# EAGLE design xyz (EAGLE 9.6.2)
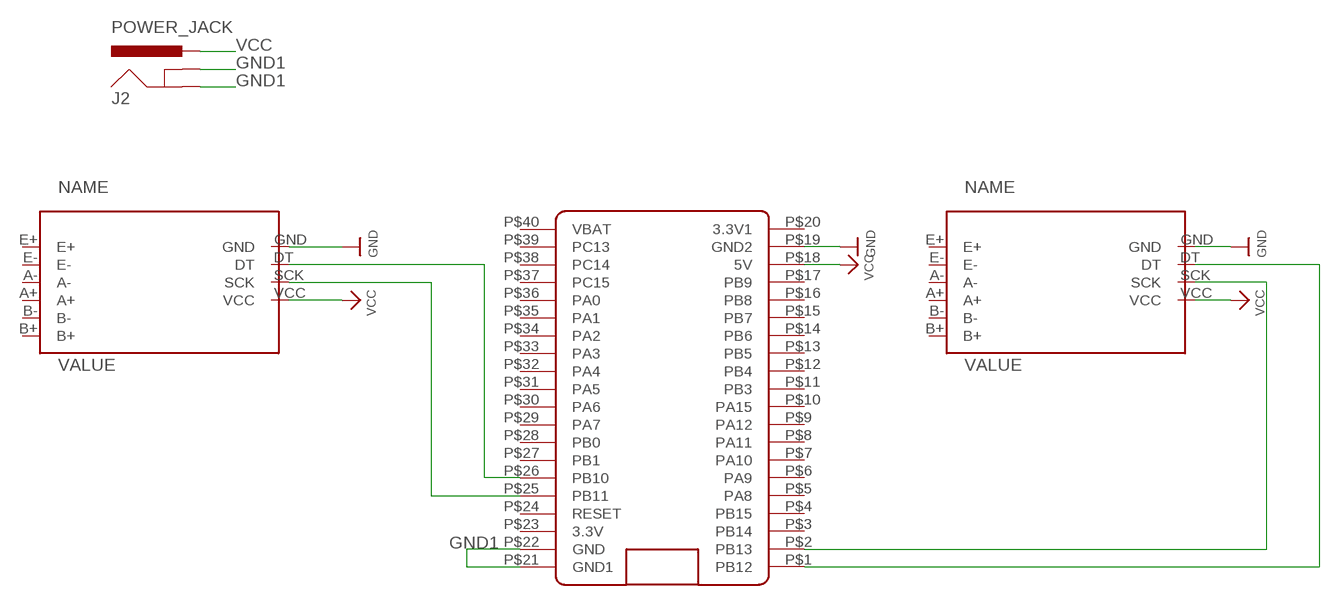
[diagram p0: schematic, sheet 1]

## Parts
J2  POWER_JACK  [POWER_JACK]
U$1  HX711A  [HX711]
U$2  HX711A  [HX711]
U$3  BLUE_PILL  [BLUE_PILL]

## Nets
GND: U$1.GND U$2.GND U$3.P$19(GND2)
GND1: J2.GNDBREAK U$3.P$21(GND1) U$3.P$22(GND)
N$1: J2.GND
N$3: U$1.DT U$3.P$26(PB10)
N$4: U$1.SCK U$3.P$25(PB11)
N$5: U$2.SCK U$3.P$2(PB13)
N$6: U$2.DT U$3.P$1(PB12)
VCC: J2.PWR U$1.VCC U$2.VCC U$3.P$18(5V)
Unconnected: U$1.A+ U$1.A- U$1.B+ U$1.B- U$1.E+ U$1.E- U$2.A+ U$2.A- U$2.B+ U$2.B- U$2.E+ U$2.E- U$3.P$3(PB14) U$3.P$4(PB15) U$3.P$5(PA8) U$3.P$6(PA9) U$3.P$7(PA10) U$3.P$8(PA11) U$3.P$9(PA12) U$3.P$10(PA15) U$3.P$11(PB3) U$3.P$12(PB4) U$3.P$13(PB5) U$3.P$14(PB6) U$3.P$15(PB7) U$3.P$16(PB8) U$3.P$17(PB9) U$3.P$20(3.3V1) U$3.P$23(3.3V) U$3.P$24(RESET) U$3.P$27(PB1) U$3.P$28(PB0) U$3.P$29(PA7) U$3.P$30(PA6) U$3.P$31(PA5) U$3.P$32(PA4) U$3.P$33(PA3) U$3.P$34(PA2) U$3.P$35(PA1) U$3.P$36(PA0) U$3.P$37(PC15) U$3.P$38(PC14) U$3.P$39(PC13) U$3.P$40(VBAT)

## Library data of the parts
J2 = J-Generic-5.5mm-Barrel-Jack:POWER_JACK: Power Jack Connector This is the standard 5.5mm barrel jack for power. The PTH is the most common, proven, reliable, footprint. The Slot footprint only works if the mill layer is transmitted to the PCB fab house so be warned. Here are the connectors we sell at SparkFun: DC Barrel Power Jack/Connector <https://www.sparkfun.com/products/119> (PRT-00119) DC Barrel Power Jack/Connector (SMD) <https://www.sparkfun.com/products/12748> (PRT-12748) DC Barrel Jack Adapter - Breadboard Compatible <https://www.sparkfun.com/products/10811> (PRT-10811) It is used on this SparkFun product (and many, many others): SparkFun RedBoard - Programmed with Arduino <https://www.sparkfun.com/products/12757> (DEV-12757) Also, if you need a mating power supply or connector, please check these out: Wall Adapter Power Supply - 9VDC 650mA <https://www.sparkfun.com/products/298> (TOL-00298) DC Barrel Jack Adapter - Male <https://www.sparkfun.com/products/10287> (PRT-10287); DPN: CP-202A-ND; MPN: PJ-202A
U$1 U$2 = HX711:HX711
U$3 = BluePill:BLUE_PILL

## Net classes
0 default: width 0.3 mm, drill 0.203 mm, clearance 0.3 mm

## Board
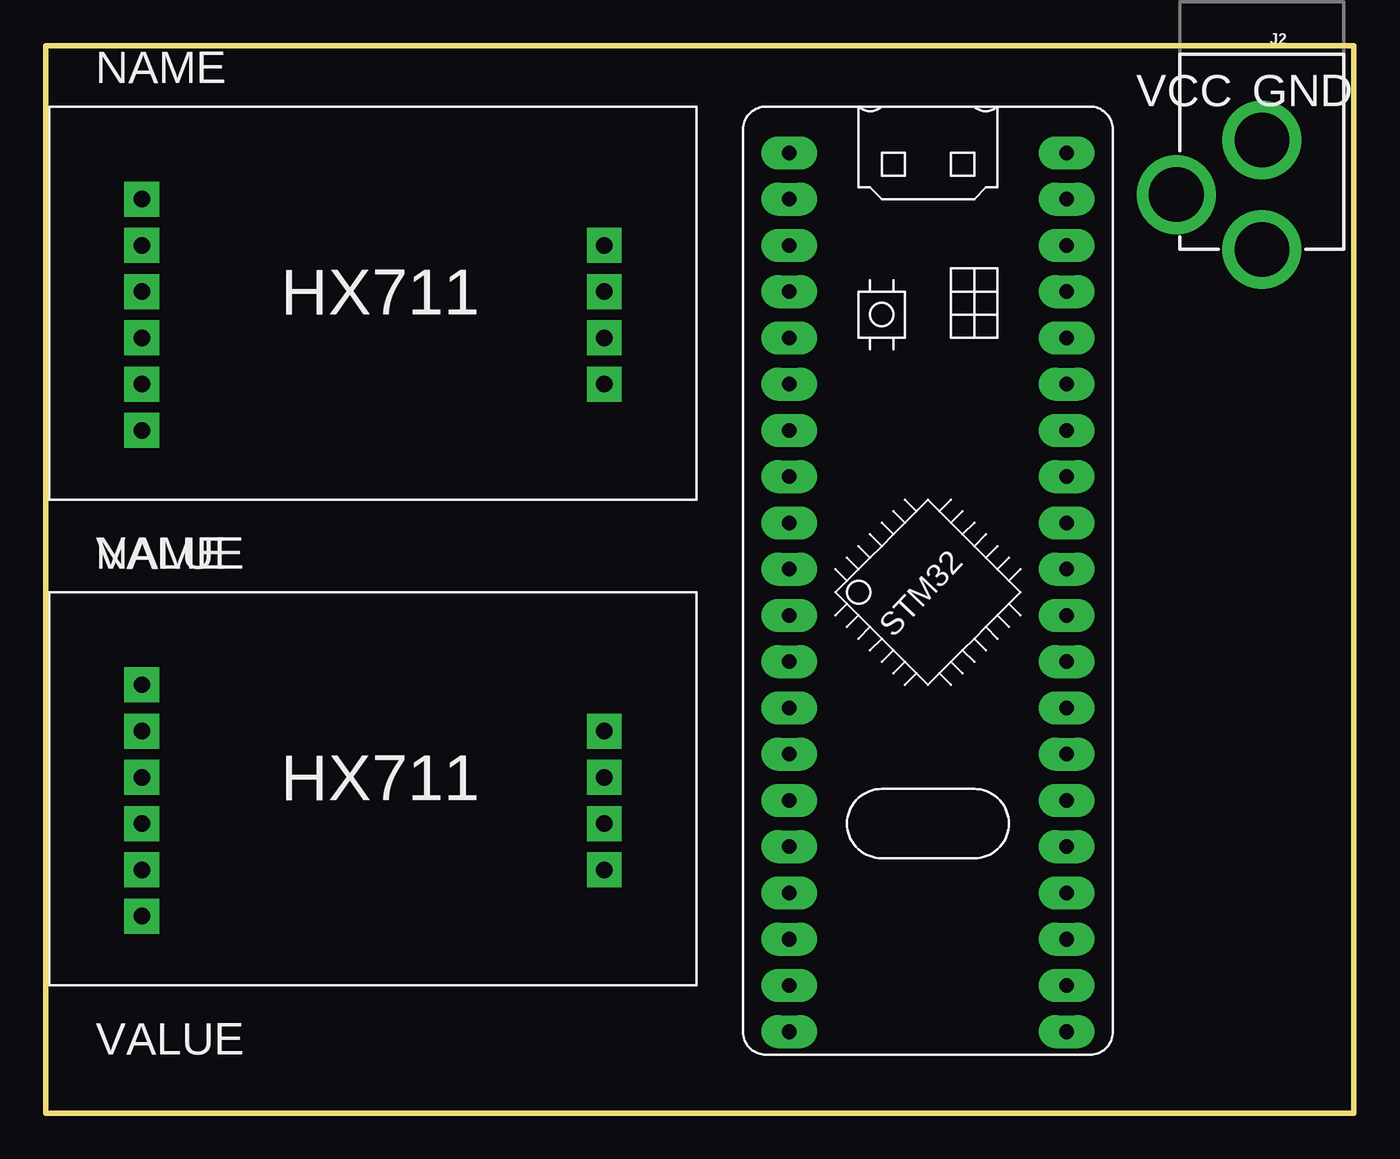
[diagram p1: board, top side]
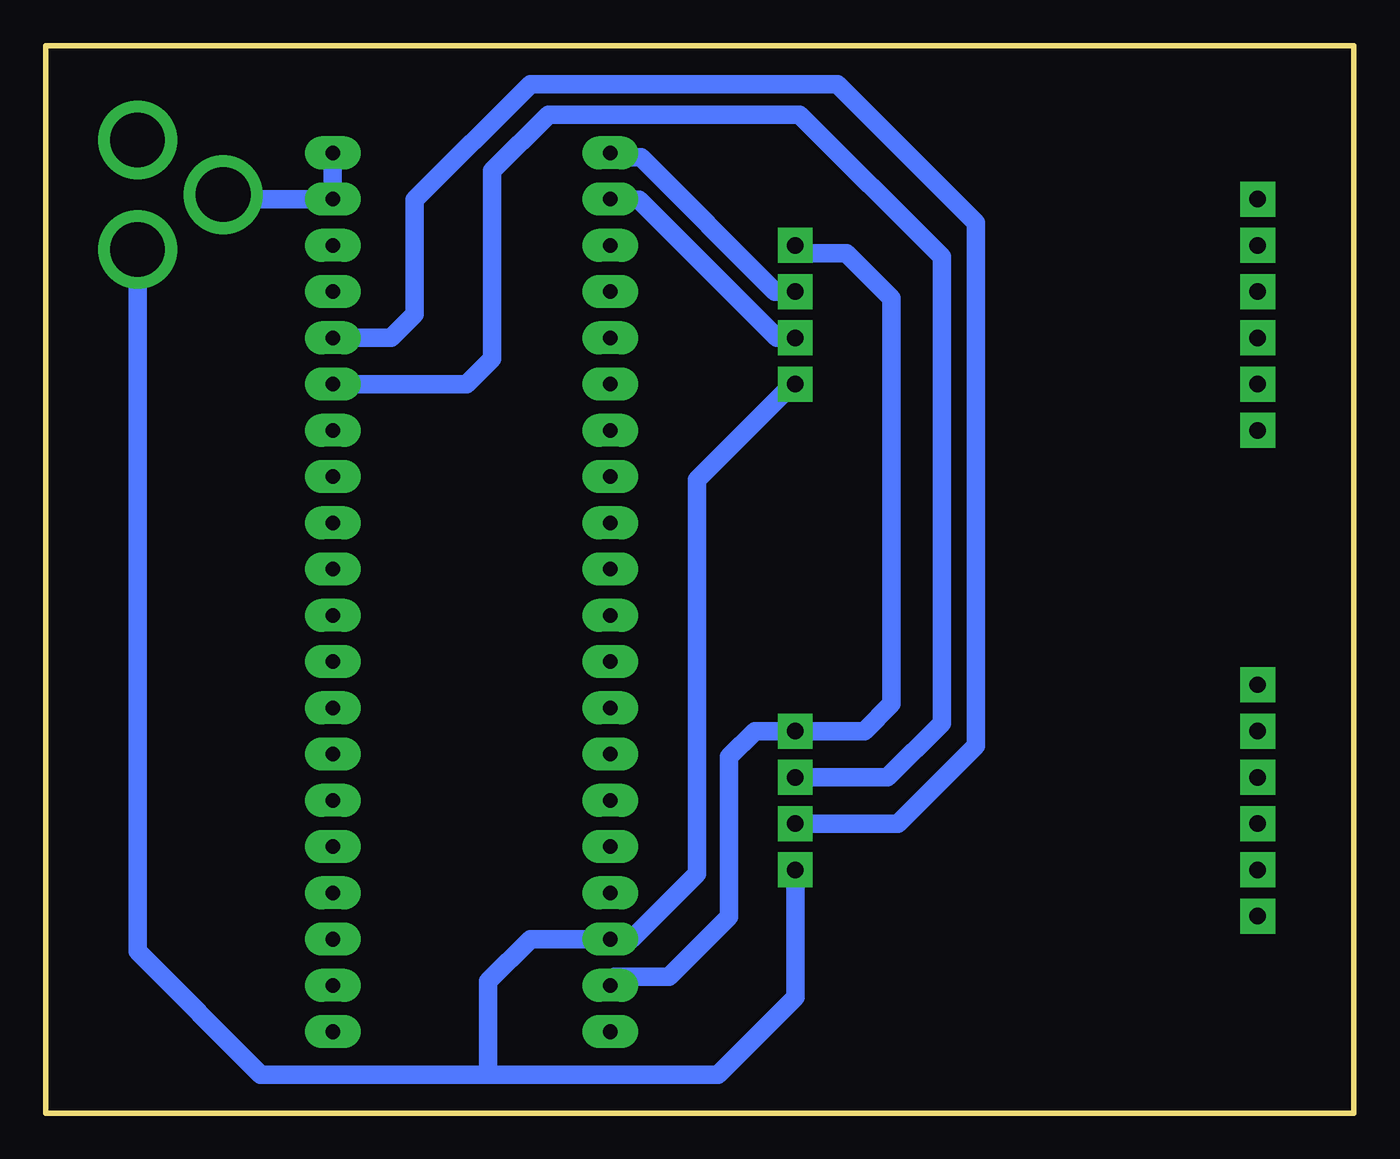
[diagram p2: board, bottom side, seen from below]

Size 71.87 x 58.63 mm. Coordinates in mm from the lower left corner, seen from the top.
Outline: 0,58.63 0,0 71.87,0 71.87,58.63 0,58.63
Copper layers (1*16): Top 0.035mm / dielectric 1.5mm / Bottom 0.035mm
Design rules "default *": minimum track width 40mil, minimum drill 0.35mm, track to track 6mil, track to pad 6mil, pad to pad 6mil, via to via 6mil, smd to smd 6mil, copper to edge 40mil, drill to drill 6mil, minimum pad ring 20mil, minimum via ring 8mil, stop-mask expansion 4mil, vias tented up to drill 0mil, thermal gap 10mil

### Footprints (pad centres in the part's own frame; a part is rotated, then mirrored left to right if it is on the bottom)
POWER_JACK = drill 2.997 pad 4.318: GND 0,7.7; GNDBREAK 4.7,10.7; PWR 0,13.7
HX711 = drill 0.9 square: A+ 8.89,21.59; A- 8.89,24.13; B+ 8.89,16.51; B- 8.89,19.05; DT 34.29,24.13; E+ 8.89,29.21; E- 8.89,26.67; GND 34.29,26.67; SCK 34.29,21.59; VCC 34.29,19.05
BLUE_PILL = drill 0.8 long: P$1 -7.62,15.24; P$2 -7.62,12.7; P$3 -7.62,10.16; P$4 -7.62,7.62; P$5 -7.62,5.08; P$6 -7.62,2.54; P$7 -7.62,0; P$8 -7.62,-2.54; P$9 -7.62,-5.08; P$10 -7.62,-7.62; P$11 -7.62,-10.16; P$12 -7.62,-12.7; P$13 -7.62,-15.24; P$14 -7.62,-17.78; P$15 -7.62,-20.32; P$16 -7.62,-22.86; P$17 -7.62,-25.4; P$18 -7.62,-27.94; P$19 -7.62,-30.48; P$20 -7.62,-33.02; P$21 7.62,15.24; P$22 7.62,12.7; P$23 7.62,10.16; P$24 7.62,7.62; P$25 7.62,5.08; P$26 7.62,2.54; P$27 7.62,0; P$28 7.62,-2.54; P$29 7.62,-5.08; P$30 7.62,-7.62; P$31 7.62,-10.16; P$32 7.62,-12.7; P$33 7.62,-15.24; P$34 7.62,-17.78; P$35 7.62,-20.32; P$36 7.62,-22.86; P$37 7.62,-25.4; P$38 7.62,-27.94; P$39 7.62,-30.48; P$40 7.62,-33.02

### Placement (x,y rotation side)
J2  66.81,61.14 180 top
U$1  -3.6,-5.68 0 top
U$2  -3.6,20.99 0 top
U$3  48.47,37.5 0 top

### Tracks (layer width: path | path; a pad name or v marks a point on that pad's centre or on a via)
GND
  Bottom 1.016: U$2.GND 30.66,47.23 27.88,47.23 25.41,44.76 25.41,22.48 26.9,20.99 U$1.GND 32.9,20.99 34.32,19.57 34.32,10.8 37.61,7.5 40.6,7.5 U$3.P$19 41.18,6.92
GND1
  Bottom 1.016: U$3.P$21 U$3.P$22 61.87,50.2 J2.GNDBREAK
N$3
  Bottom 1.016: U$1.DT 25.62,18.45 22.64,21.42 22.64,47.03 30.45,54.84 44.25,54.84 47.33,51.75 47.33,41.44 48.73,40.04 U$3.P$26
N$4
  Bottom 1.016: U$3.P$25 52.89,42.58 51.59,43.88 51.59,50.15 45.23,56.51 28.37,56.51 20.77,48.91 20.77,20.17 25.04,15.91 U$1.SCK
N$5
  Bottom 1.016: 30.69,42.78 U$2.SCK 31.69,42.58 39.26,50.15 40.6,50.15 U$3.P$2
N$6
  Bottom 1.016: U$3.P$1 40.6,52.49 39.16,52.49 31.79,45.12 U$2.DT
VCC
  Bottom 1.016: U$2.VCC 31.25,39.63 36.09,34.8 36.09,13.15 39.67,9.56 U$3.P$18 45.24,9.56 47.56,7.24 47.56,2.13 | 47.56,2.13 60.04,2.13 66.81,8.9 J2.PWR | 47.56,2.13 34.93,2.13 30.69,6.37 U$1.VCC

### Text on the board
tNames: VCC | GND